# Altium schematic sheet Power.SchDoc
size A; SheetNumber: 2; SheetTotal: 6
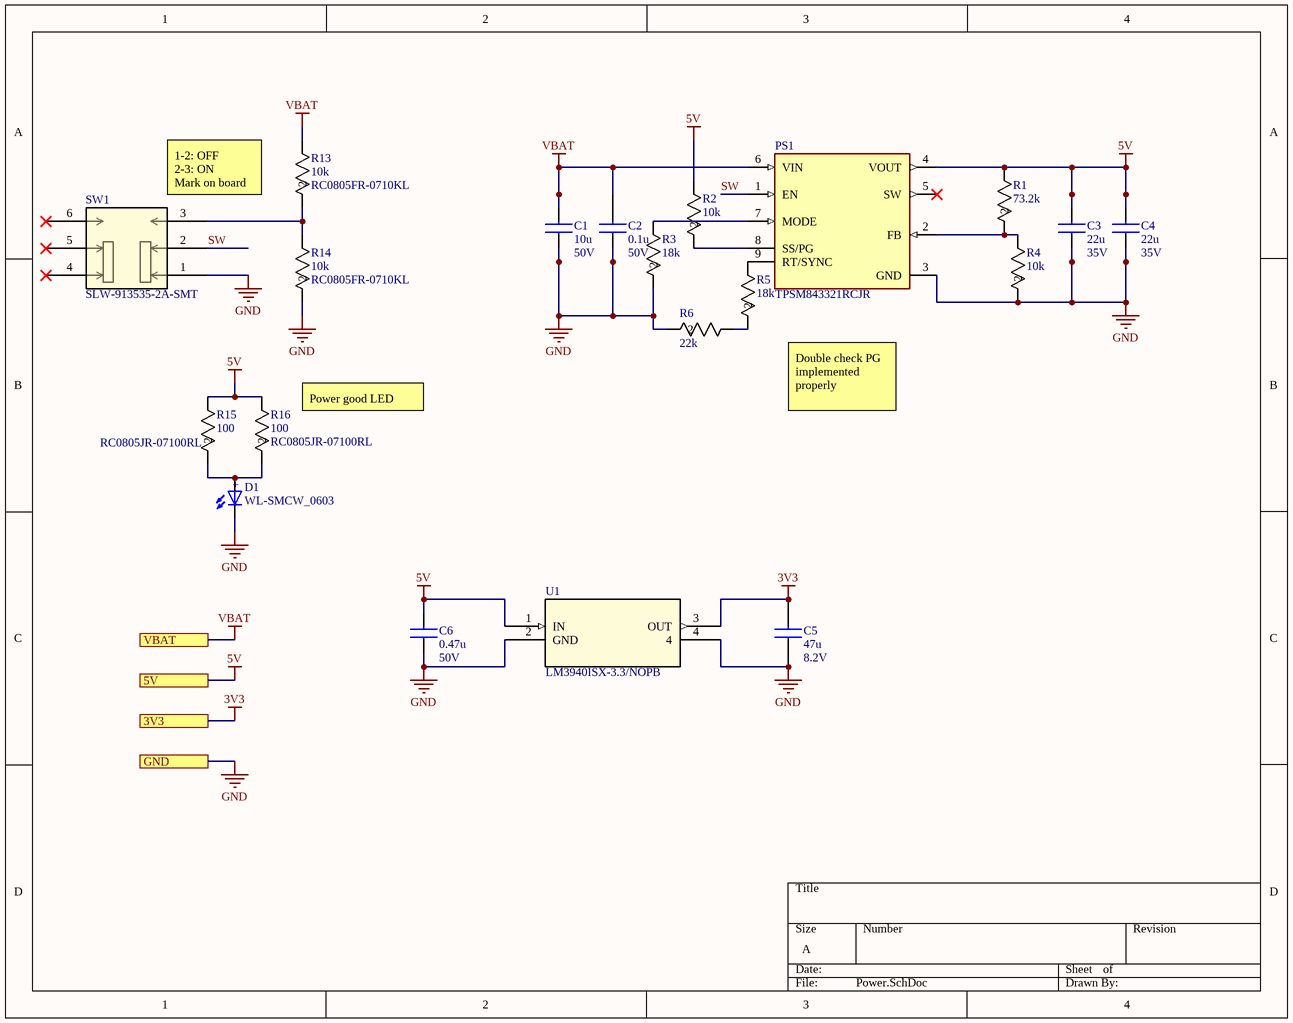
[diagram p0: Power.SchDoc]

## Parts
C1  value 10u  Rated Voltage: 50V  [CAPC2012X145N]  (hidden comment: C2012X5R1H106K125AC)
C2  value 0.1u  Rated Voltage: 50V  [CAPC2012X145N]  (hidden comment: KAM21BR71H104JM)
C3  value 22u  Rated Voltage: 35V  [CAPC2012X145N]  (hidden comment: C2012X5R1V226M125AC)
C4  value 22u  Rated Voltage: 35V  [CAPC2012X145N]  (hidden comment: C2012X5R1V226M125AC)
C5  value 47u  Rated Voltage: 8.2V  [CAPC2012X145N]  (hidden comment: T58W0476M8R2C0500)
C6  value 0.47u  Rated Voltage: 50V  [CAPC2012X145N]  (hidden comment: GCM21BR71H474KA55K)
D1  WL-SMCW_0603  [WL-SMCW_0603]
PS1  TPSM843321RCJR  [MODULE_TPSM843321RCJR]
R1  value 73.2k  [RC0805N_YAG]  (hidden comment: RC0805FR-0773K2L)
R2  value 10k  [RC0805N_YAG]  (hidden comment: RC0805FR-0710KL)
R3  value 18k  [RC0805N_YAG]  (hidden comment: RC0805FR-0718KL)
R4  value 10k  [RC0805N_YAG]  (hidden comment: RC0805FR-0710KL)
R5  value 18k  [RC0805N_YAG]  (hidden comment: RC0805FR-0718KL)
R6  value 22k  [RC0805N_YAG]  (hidden comment: RC0805FR-0722KL)
R13  RC0805FR-0710KL  value 10k  [RC0805N_YAG]
R14  RC0805FR-0710KL  value 10k  [RC0805N_YAG]
R15  RC0805JR-07100RL  value 100  [RC0805N_YAG]
R16  RC0805JR-07100RL  value 100  [RC0805N_YAG]
SW1  SLW-913535-2A-SMT  [SLW-913535_CUD]
U1  LM3940ISX-3.3/NOPB  [TS3B]

## Ports
3V3, 5V, GND, VBAT

## Nets
3V3: C5.2 U1.3(OUT) ; port 3V3
5V: C3.2 C4.2 C6.2 PS1.4(VOUT) R1.1 R2.1 R15.1 R16.1 U1.1(IN) ; port 5V
GND: C1.1 C2.1 C3.1 C4.1 C5.1 C6.1 D1.1(NEG) PS1.3(GND) R3.2 R4.2 R6.2 R14.2 SW1.1 U1.2(GND) U1.4 ; port GND
VBAT: C1.2 C2.2 PS1.6(VIN) R13.1 ; port VBAT
SW: PS1.1(EN) SW1.2
NetD1_2: D1.2(POS) R15.2 R16.2
NetPS1_2: PS1.2(FB) R1.2 R4.1
NetPS1_7: PS1.7(MODE) R3.1
NetPS1_8: PS1.8(SS/PG) R2.2
NetPS1_9: PS1.9(RT/SYNC) R5.1
NetR5_2: R5.2 R6.1
NetR13_2: R13.2 R14.1 SW1.3

Not connected (* = marked no-connect by the designer): PS1 5(SW)*; SW1 4* 5* 6*

## Notes on the sheet
- 1-2: OFF
  2-3: ON
  Mark on board
- (near R16) Power good LED
- Double check PG implemented properly
- (in symbol WL-SMCW_0603) +

## Library data of the parts
C1 = C2012X5R1H106K125AC: Multilayer Ceramic Chip Capacitors, Capacitance=10?F, LxWxT:2x1.25x1.25mm; Manufacturer_Name: TDK; Geometry.Height: 1.45mm; Mouser Part Number: 810-C2012X5R1H106K12; Mouser Price/Stock: https://www.mouser.co.uk/ProductDetail/TDK/C2012X5R1H106K125AC?qs=rSMjJ%252B1ewcQGpfDVduhUmg%3D%3D; Manufacturer_Part_Number: C2012X5R1H106K125AC; Datasheet Link: https://product.tdk.com/info/en/catalog/datasheets/mlcc_commercial_midvoltage_en.pdf
C2 = KAM21BR71H104JM: Multilayer Ceramic Chip Capacitors, Capacitance=0.1u; Manufacturer_Part_Number: KAM21BR71H104JM
C3 C4 = C2012X5R1V226M125AC: Multilayer Ceramic Chip Capacitors, Capacitance=22u; Manufacturer_Part_Number: C2012X5R1V226M125AC
C5 = T58W0476M8R2C0500: 47 µF Molded Tantalum Polymer Capacitor 8.2 V 0805 (2012 Metric) 500mOhm @ 100kHz; Manufacturer_Part_Number: T58W0476M8R2C0500
C6 = GCM21BR71H474KA55K: Multilayer Ceramic Chip Capacitors, Capacitance=0.47u; Manufacturer_Part_Number: GCM21BR71H474KA55K
D1 = WL-SMCW_0603: 0603, Green Typ.(@20mA): 520nm, 430mcd, 3.2V, 140Â° InGaN; MF: Wurth Electronics; MP: 150060GS75000; SnapEDA_Link: https://www.snapeda.com/parts/150060GS75000/Wurth+Electronics/view-part/?ref=snap; Package: 0603 WÃ¼rth Elektronik; Value: *; Check_prices: https://www.snapeda.com/parts/150060GS75000/Wurth+Electronics/view-part/?ref=eda
PS1 = TPSM843321RCJR: Non-Isolated PoL Module DC DC Converter 1 Output 5V 3A 3.8V - 18V Input; MF: Texas Instruments; SnapEDA_Link: https://www.snapeda.com/parts/TPSM843321RCJR/Texas+Instruments/view-part/?ref=snap; Package: None; Value: *; MP: TPSM843321RCJR; Check_prices: https://www.snapeda.com/parts/TPSM843321RCJR/Texas+Instruments/view-part/?ref=eda
R1 = RC0805FR-0773K2L: RES 0805 73.2k 1% 1/8W; Manufacturer_Name: Yageo; Manufacturer_Part_Number: RC0805FR-0773K2L; Tolerance: 1%
R2 R4 R13 R14 = RC0805FR-0710KL: RES 0805 10k 1% 1/8W; Manufacturer_Name: Yageo; Manufacturer_Part_Number: RC0805FR-0710KL; Tolerance: 1%
R3 R5 = RC0805FR-0718KL: RES 0805 18k 1% 1/8W; Manufacturer_Name: Yageo; Manufacturer_Part_Number: RC0805FR-0718KL; Tolerance: 1%
R6 = RC0805FR-0722KL: RES 0805 22k 1% 1/8W; Manufacturer_Name: Yageo; Manufacturer_Part_Number: RC0805FR-0722KL; Tolerance: 1%
R15 R16 = RC0805JR-07100RL: RES 0805 100 5% 1/8W; Manufacturer_Name: Yageo; Manufacturer_Part_Number: RC0805JR-07100RL; Tolerance: 5%
SW1 = SLW-913535-2A-SMT: No Description Available; Manufacturer_Name: Same Sky; Type: Slide Switches; Copyright: Copyright (C) 2025 Ultra Librarian. All rights reserved.; Manufacturer_Part_Number: SLW-913535-2A-SMT; RefDes: RefDes
U1 = LM3940ISX-3.3NOPB: 1-A, low-dropout voltage regulator for 5-V to 3.3-V conversion 3-DDPAK/TO-263 -40 to 125; Manufacturer_Name: Texas Instruments; Type: LM3940IS-3.3; Copyright: Copyright (C) 2025 Ultra Librarian. All rights reserved.; Manufacturer_Part_Number: LM3940ISX-3.3/NOPB; Datasheet: https://www.ti.com/lit/gpn/lm3940; RefDes: RefDes